# EAGLE design fcu-display (EAGLE 9.5.2)
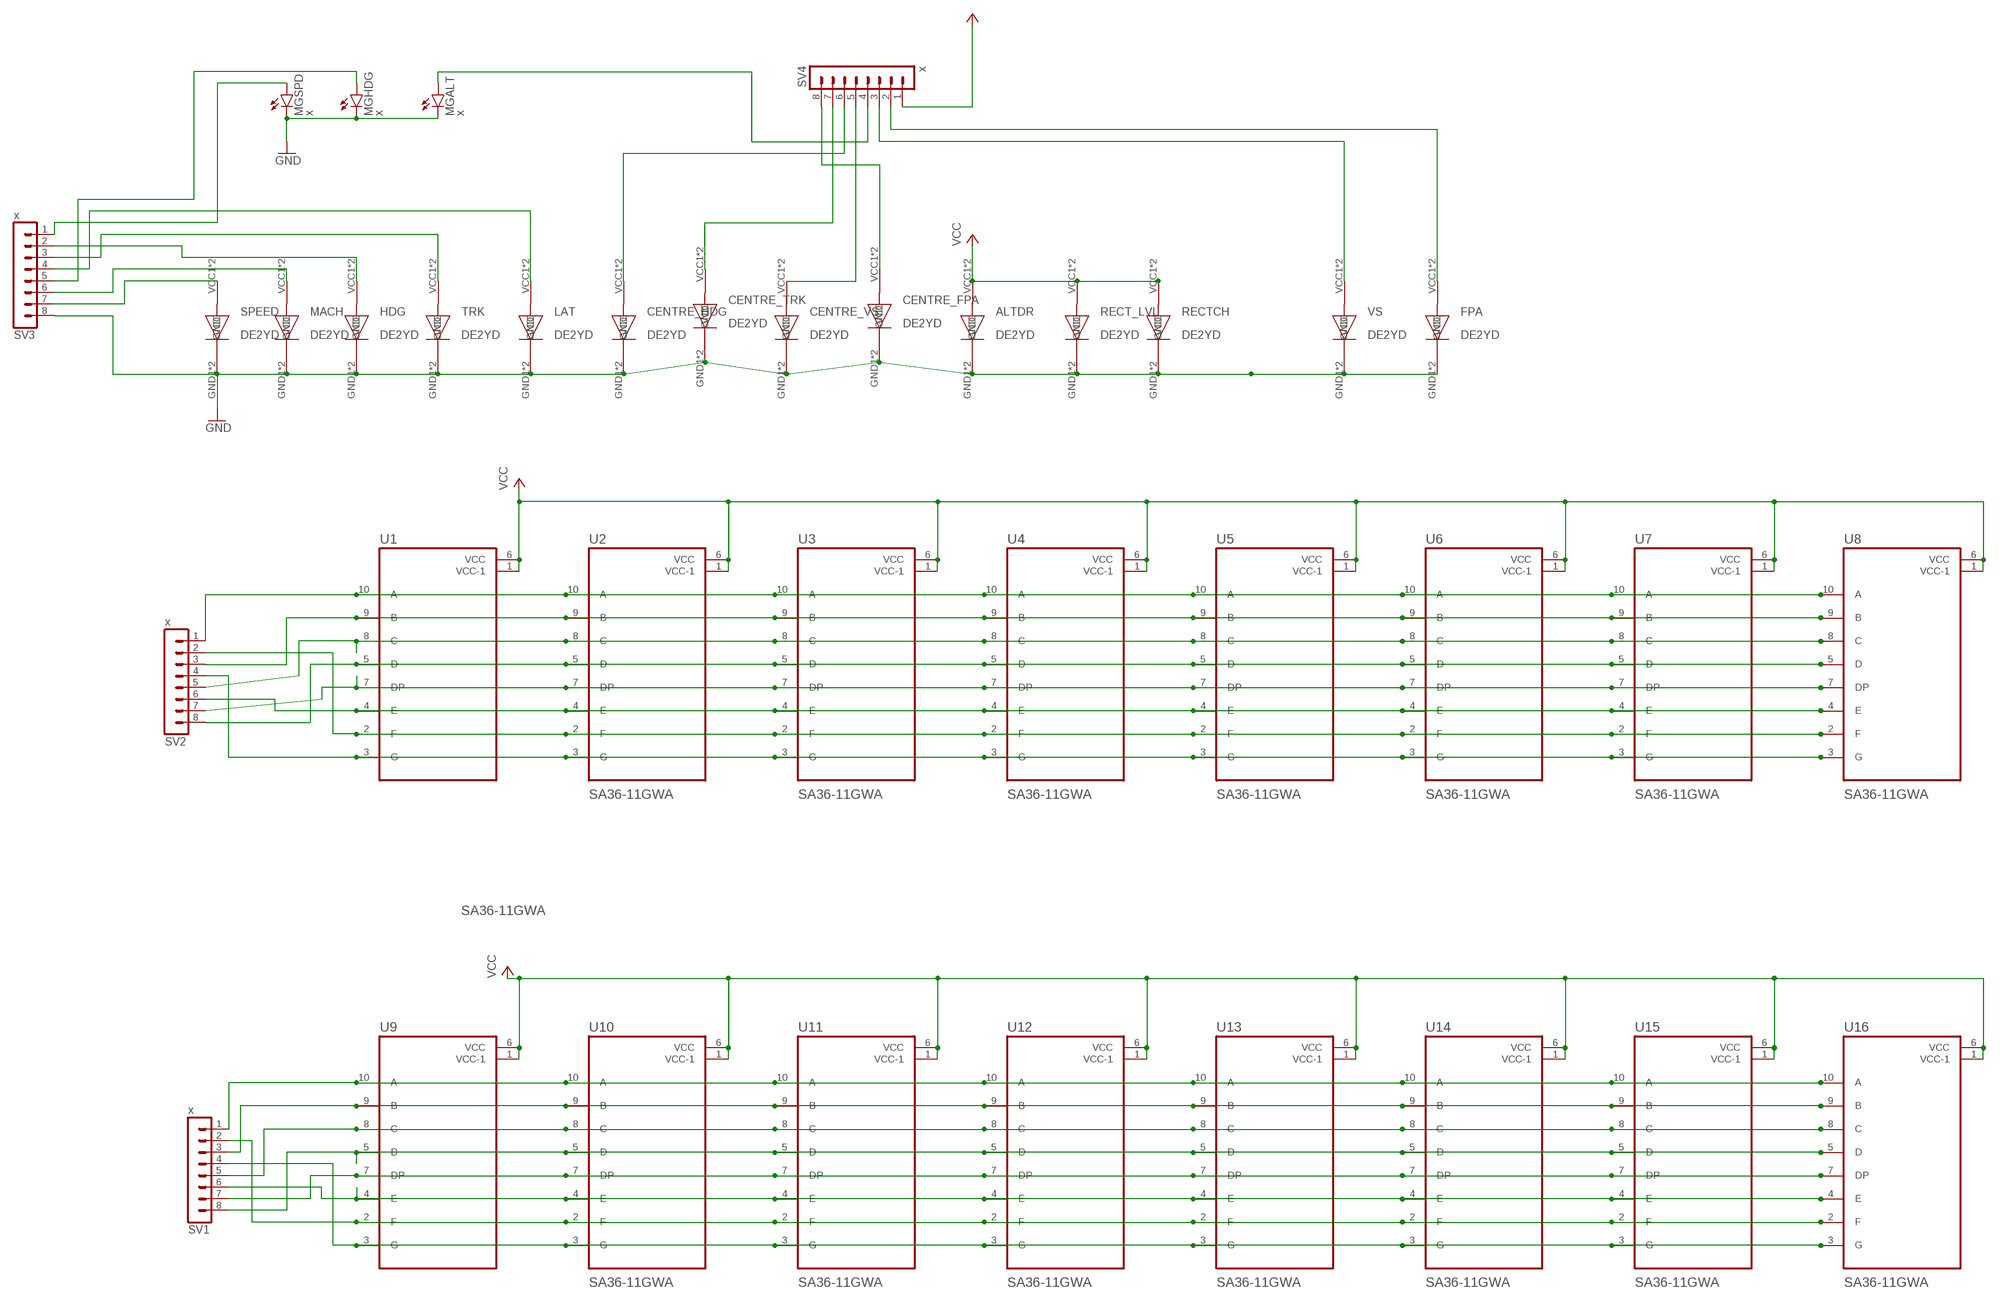
[diagram p0: schematic, sheet 1]

## Parts
ALTDR  DE2YD  [STANDARD]
CENTRE_FPA  DE2YD  [STANDARD]
CENTRE_HDG  DE2YD  [STANDARD]
CENTRE_TRK  DE2YD  [STANDARD]
CENTRE_VS  DE2YD  [STANDARD]
FPA  DE2YD  [STANDARD]
HDG  DE2YD  [STANDARD]
LAT  DE2YD  [STANDARD]
MACH  DE2YD  [STANDARD]
MGALT  x  LED3MM  [LED3MM]
MGHDG  x  LED3MM  [LED3MM]
MGSPD  x  LED3MM  [LED3MM]
RECT_LVL  DE2YD  [STANDARD]
RECTCH  DE2YD  [STANDARD]
SPEED  DE2YD  [STANDARD]
SV1  x  MA08-1  [MA08-1]
SV2  x  MA08-1  [MA08-1]
SV3  x  MA08-1  [MA08-1]
SV4  x  MA08-1  [MA08-1]
TRK  DE2YD  [STANDARD]
U1  SA36-11GWA  [KINGBRIGHT_SC36-11SRWA]
U2  SA36-11GWA  [KINGBRIGHT_SC36-11SRWA]
U3  SA36-11GWA  [KINGBRIGHT_SC36-11SRWA]
U4  SA36-11GWA  [KINGBRIGHT_SC36-11SRWA]
U5  SA36-11GWA  [KINGBRIGHT_SC36-11SRWA]
U6  SA36-11GWA  [KINGBRIGHT_SC36-11SRWA]
U7  SA36-11GWA  [KINGBRIGHT_SC36-11SRWA]
U8  SA36-11GWA  [KINGBRIGHT_SC36-11SRWA]
U9  SA36-11GWA  [KINGBRIGHT_SC36-11SRWA]
U10  SA36-11GWA  [KINGBRIGHT_SC36-11SRWA]
U11  SA36-11GWA  [KINGBRIGHT_SC36-11SRWA]
U12  SA36-11GWA  [KINGBRIGHT_SC36-11SRWA]
U13  SA36-11GWA  [KINGBRIGHT_SC36-11SRWA]
U14  SA36-11GWA  [KINGBRIGHT_SC36-11SRWA]
U15  SA36-11GWA  [KINGBRIGHT_SC36-11SRWA]
U16  SA36-11GWA  [KINGBRIGHT_SC36-11SRWA]
VS  DE2YD  [STANDARD]

## Nets
GND: ALTDR.GND1(GND) ALTDR.GND2(GND) CENTRE_FPA.GND1(GND) CENTRE_FPA.GND2(GND) CENTRE_HDG.GND1(GND) CENTRE_HDG.GND2(GND) CENTRE_TRK.GND1(GND) CENTRE_TRK.GND2(GND) CENTRE_VS.GND1(GND) CENTRE_VS.GND2(GND) FPA.GND1(GND) FPA.GND2(GND) HDG.GND1(GND) HDG.GND2(GND) LAT.GND1(GND) LAT.GND2(GND) MACH.GND1(GND) MACH.GND2(GND) MGALT.K(C) MGHDG.K(C) MGSPD.K(C) RECT_LVL.GND1(GND) RECT_LVL.GND2(GND) RECTCH.GND1(GND) RECTCH.GND2(GND) SPEED.GND1(GND) SPEED.GND2(GND) SV3.8 TRK.GND1(GND) TRK.GND2(GND) VS.GND1(GND) VS.GND2(GND)
N$1: SV2.1 U1.10(A) U2.10(A) U3.10(A) U4.10(A) U5.10(A) U6.10(A) U7.10(A) U8.10(A)
N$2: LAT.VCC1(VCC) LAT.VCC2(VCC) SV3.4
N$3: SV2.5 U1.8(C) U2.8(C) U3.8(C) U4.8(C) U5.8(C) U6.8(C) U7.8(C) U8.8(C)
N$4: MGSPD.A SV3.1
N$5: SV2.7 U1.7(DP) U2.7(DP) U3.7(DP) U4.7(DP) U5.7(DP) U6.7(DP) U7.7(DP) U8.7(DP)
N$6: MGHDG.A SV3.5
N$7: SV2.2 U1.2(F) U2.2(F) U3.2(F) U4.2(F) U5.2(F) U6.2(F) U7.2(F) U8.2(F)
N$8: FPA.VCC1(VCC) FPA.VCC2(VCC) SV4.2
N$9: SV4.3 VS.VCC1(VCC) VS.VCC2(VCC)
N$10: CENTRE_FPA.VCC1(VCC) CENTRE_FPA.VCC2(VCC) SV4.8
N$11: CENTRE_TRK.VCC1(VCC) CENTRE_TRK.VCC2(VCC) SV4.7
N$12: CENTRE_HDG.VCC1(VCC) CENTRE_HDG.VCC2(VCC) SV4.6
N$13: SV1.1 U9.10(A) U10.10(A) U11.10(A) U12.10(A) U13.10(A) U14.10(A) U15.10(A) U16.10(A)
N$14: SPEED.VCC1(VCC) SPEED.VCC2(VCC) SV3.7
N$15: MACH.VCC1(VCC) MACH.VCC2(VCC) SV3.6
N$16: SV1.5 U9.8(C) U10.8(C) U11.8(C) U12.8(C) U13.8(C) U14.8(C) U15.8(C) U16.8(C)
N$17: HDG.VCC1(VCC) HDG.VCC2(VCC) SV3.2
N$18: SV1.7 U9.7(DP) U10.7(DP) U11.7(DP) U12.7(DP) U13.7(DP) U14.7(DP) U15.7(DP) U16.7(DP)
N$19: SV3.3 TRK.VCC1(VCC) TRK.VCC2(VCC)
N$20: SV1.2 U9.2(F) U10.2(F) U11.2(F) U12.2(F) U13.2(F) U14.2(F) U15.2(F) U16.2(F)
N$21: CENTRE_VS.VCC1(VCC) CENTRE_VS.VCC2(VCC) SV4.5
N$22: MGALT.A SV4.4
N$28: SV1.4 U9.3(G) U10.3(G) U11.3(G) U12.3(G) U13.3(G) U14.3(G) U15.3(G) U16.3(G)
N$29: SV1.6 U9.4(E) U10.4(E) U11.4(E) U12.4(E) U13.4(E) U14.4(E) U15.4(E) U16.4(E)
N$30: SV1.8 U9.5(D) U10.5(D) U11.5(D) U12.5(D) U13.5(D) U14.5(D) U15.5(D) U16.5(D)
N$31: SV1.3 U9.9(B) U10.9(B) U11.9(B) U12.9(B) U13.9(B) U14.9(B) U15.9(B) U16.9(B)
N$57: SV2.4 U1.3(G) U2.3(G) U3.3(G) U4.3(G) U5.3(G) U6.3(G) U7.3(G) U8.3(G)
N$59: SV2.6 U1.4(E) U2.4(E) U3.4(E) U4.4(E) U5.4(E) U6.4(E) U7.4(E) U8.4(E)
N$61: SV2.8 U1.5(D) U2.5(D) U3.5(D) U4.5(D) U5.5(D) U6.5(D) U7.5(D) U8.5(D)
N$63: SV2.3 U1.9(B) U2.9(B) U3.9(B) U4.9(B) U5.9(B) U6.9(B) U7.9(B) U8.9(B)
VCC: ALTDR.VCC1(VCC) ALTDR.VCC2(VCC) RECT_LVL.VCC1(VCC) RECT_LVL.VCC2(VCC) RECTCH.VCC1(VCC) RECTCH.VCC2(VCC) SV4.1 U1.1(VCC-1) U1.6(VCC) U2.1(VCC-1) U2.6(VCC) U3.1(VCC-1) U3.6(VCC) U4.1(VCC-1) U4.6(VCC) U5.1(VCC-1) U5.6(VCC) U6.1(VCC-1) U6.6(VCC) U7.1(VCC-1) U7.6(VCC) U8.1(VCC-1) U8.6(VCC) U9.1(VCC-1) U9.6(VCC) U10.1(VCC-1) U10.6(VCC) U11.1(VCC-1) U11.6(VCC) U12.1(VCC-1) U12.6(VCC) U13.1(VCC-1) U13.6(VCC) U14.1(VCC-1) U14.6(VCC) U15.1(VCC-1) U15.6(VCC) U16.1(VCC-1) U16.6(VCC)

## Library data of the parts
ALTDR CENTRE_FPA CENTRE_HDG CENTRE_TRK CENTRE_VS FPA HDG LAT MACH RECT_LVL RECTCH SPEED TRK VS = kingbright-de2yd-lightbar:DE2YD
MGALT MGHDG MGSPD = led:LED: LED OSRAM: - CHIPLED LG R971, LG N971, LY N971, LG Q971, LY Q971, LO R971, LY R971 LH N974, LH R974 LS Q976, LO Q976, LY Q976 LO Q996 - Hyper CHIPLED LW Q18S LB Q993, LB Q99A, LB R99A - SideLED LS A670, LO A670, LY A670, LG A670, LP A670 LB A673, LV A673, LT A673, LW A673 LH A674 LY A675 LS A676, LA A676, LO A676, LY A676, LW A676 LS A679, LY A679, LG A679 - Hyper Micro SIDELED® LS Y876, LA Y876, LO Y876, LY Y876 LT Y87S - SmartLED LW L88C, LW L88S LB L89C, LB L89S, LG L890 LS L89K, LO L89K, LY L89K LS L896, LA L896, LO L896, LY L896 - TOPLED LS T670, LO T670, LY T670, LG T670, LP T670 LSG T670, LSP T670, LSY T670, LOP T670, LYG T670 LG T671, LOG T671, LSG T671 LB T673, LV T673, LT T673, LW T673 LH T674 LS T676, LA T676, LO T676, LY T676, LB T676, LH T676, LSB T676, LW T676 LB T67C, LV T67C, LT T67C, LS T67K, LO T67K, LY T67K, LW E67C LS E67B, LA E67B, LO E67B, LY E67B, LB E67C, LV E67C, LT E67C LW T67C LS T679, LY T679, LG T679 LS T770, LO T770, LY T770, LG T770, LP T770 LB T773, LV T773, LT T773, LW T773 LH T774 LS E675, LA E675, LY E675, LS T675 LS T776, LA T776, LO T776, LY T776, LB T776 LHGB T686 LT T68C, LB T68C - Hyper Mini TOPLED® LB M676 - Mini TOPLED Santana® LG M470 LS M47K, LO M47K, LY M47K Source: http://www.osram.convergy.de LUXEON: - LUMILED® LXK2-PW12-R00, LXK2-PW12-S00, LXK2-PW14-U00, LXK2-PW14-V00 LXK2-PM12-R00, LXK2-PM12-S00, LXK2-PM14-U00 LXK2-PE12-Q00, LXK2-PE12-R00, LXK2-PE12-S00, LXK2-PE14-T00, LXK2-PE14-U00 LXK2-PB12-K00, LXK2-PB12-L00, LXK2-PB12-M00, LXK2-PB14-N00, LXK2-PB14-P00, LXK2-PB14-Q00 LXK2-PR12-L00, LXK2-PR12-M00, LXK2-PR14-Q00, LXK2-PR14-R00 LXK2-PD12-Q00, LXK2-PD12-R00, LXK2-PD12-S00 LXK2-PH12-R00, LXK2-PH12-S00 LXK2-PL12-P00, LXK2-PL12-Q00, LXK2-PL12-R00 Source: www.luxeon.com KINGBRIGHT: KA-3528ASYC Source: www.kingbright.com
SV1-SV4 = con-lstb:MA08-1: PIN HEADER; OC_FARNELL: unknown; OC_NEWARK: unknown
U1-U16 = SA36-11GWA:SA36-11GWA: None; AVAILABILITY: Unavailable; DESCRIPTION: Character LED Display Module Green 7-Segment 1 Character Common Anode 2.2V 20mA 0.551 H x 0.295 W x 0.335 D _14.00mm x 7.50mm x 8.50mm_ 10-DIP _0.200, 5.08mm_; MF: Kingbright; MP: SA36-11GWA; PACKAGE: DIP-10 Kingbright; PRICE: None

## Net classes
0 default: width 0.406 mm

## Board
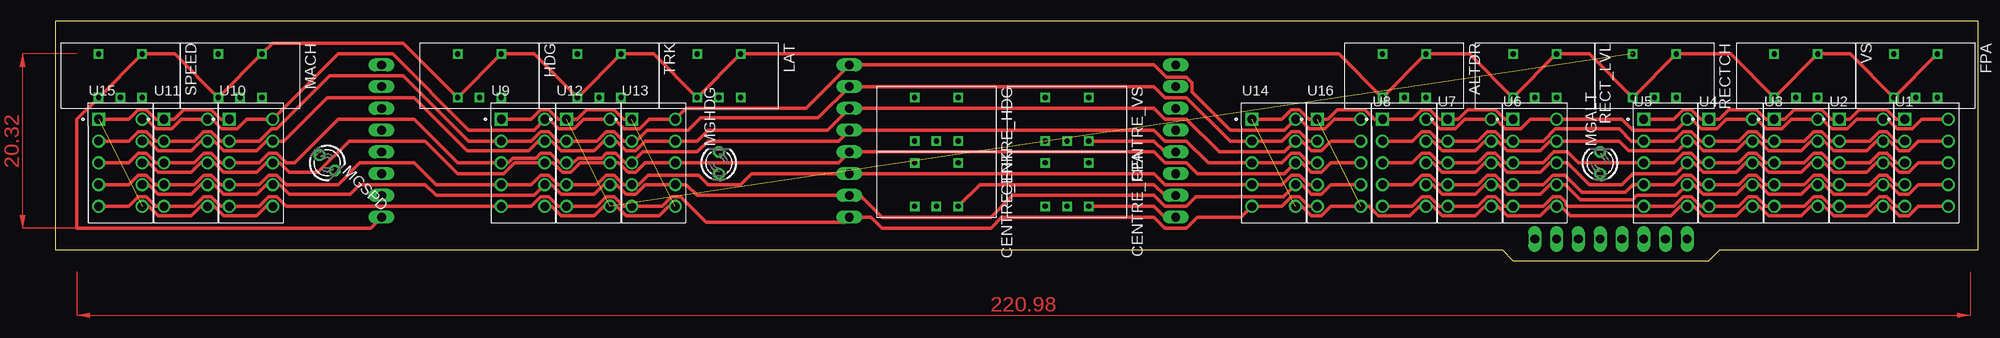
[diagram p1: board, top side]
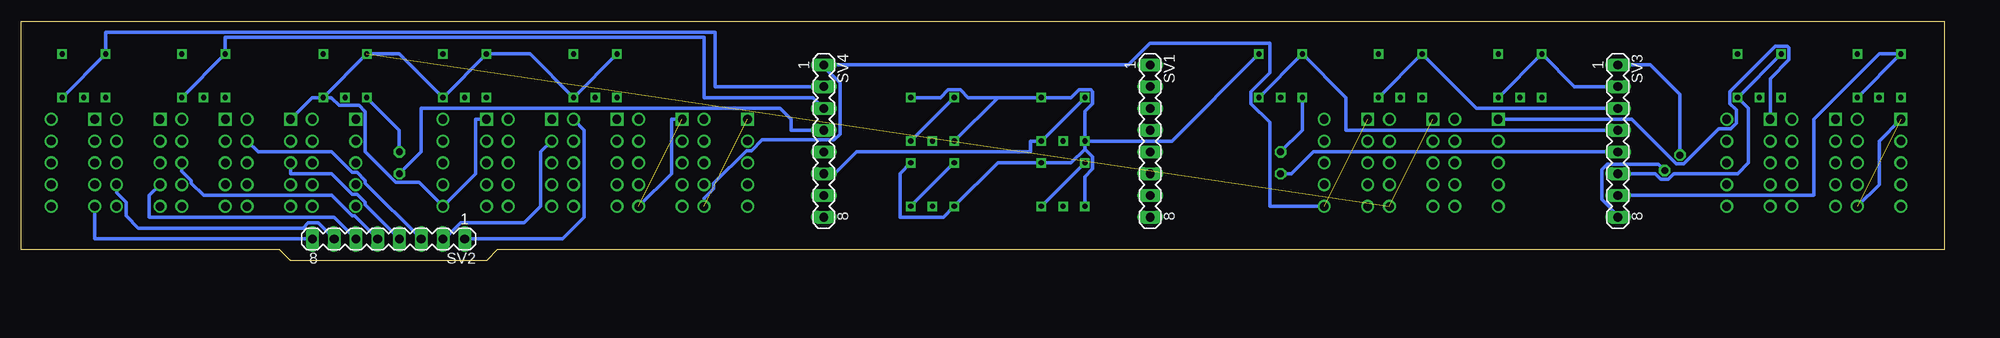
[diagram p2: board, bottom side, seen from below]

Size 224.46 x 27.93 mm. Coordinates in mm from the lower left corner, seen from the top.
Outline: 0,1.27 168.91,1.27 170.18,0 193.04,0 194.31,1.27 224.46,1.27 224.46,27.93 0,27.93 0,1.27
Copper layers (1*16): Top 0.035mm / dielectric 1.5mm / Bottom 0.035mm
Design rules "default": minimum track width 6mil, minimum drill 0.35mm, track to track 6mil, track to pad 6mil, pad to pad 6mil, via to via 6mil, smd to smd 6mil, copper to edge 40mil, drill to drill 6mil, minimum pad ring 10mil, minimum via ring 8mil, stop-mask expansion 4mil, vias tented up to drill 0mil, thermal gap 10mil

### Footprints (pad centres in the part's own frame; a part is rotated, then mirrored left to right if it is on the bottom)
STANDARD = drill 0.6 square: GND1 1.27,-2.54; GND2 -3.81,2.54; NC 1.27,0; VCC1 -3.81,-2.54; VCC2 1.27,2.54
LED3MM = drill 0.813 octagon: A -1.27,0; K 1.27,0
MA08-1 = drill 1.016 long: 1 -8.89,0; 2 -6.35,0; 3 -3.81,0; 4 -1.27,0; 5 1.27,0; 6 3.81,0; 7 6.35,0; 8 8.89,0
KINGBRIGHT_SC36-11SRWA = drill 1 square: 1 -2.54,5.08 | drill 1: 2 -2.54,2.54; 3 -2.54,0; 4 -2.54,-2.54; 5 -2.54,-5.08; 6 2.54,-5.08; 7 2.54,-2.54; 8 2.54,0; 9 2.54,2.54; 10 2.54,5.08

### Placement (x,y rotation side)
ALTDR  157.48,20.32 270 top
CENTRE_FPA  118.11,7.62 270 top
CENTRE_HDG  102.87,15.24 270 top
CENTRE_TRK  102.87,7.62 270 top
CENTRE_VS  118.11,15.24 270 top
FPA  217.17,20.32 270 top
HDG  49.53,20.32 270 top
LAT  77.47,20.32 270 top
MACH  21.59,20.32 270 top
MGALT  180.34,11.43 90 top
MGHDG  77.47,11.43 90 top
MGSPD  31.75,11.43 315 top
RECT_LVL  172.72,20.32 270 top
RECTCH  186.69,20.32 270 top
SPEED  7.62,20.32 270 top
SV1  92.71,13.97 270 bottom
SV2  181.61,2.54 180 bottom
SV3  38.1,13.97 270 bottom
SV4  130.81,13.97 270 bottom
TRK  63.5,20.32 270 top
U1  218.44,11.43 0 top
U2  210.82,11.43 0 top
U3  203.2,11.43 0 top
U4  195.58,11.43 0 top
U5  187.96,11.43 0 top
U6  172.72,11.43 0 top
U7  165.1,11.43 0 top
U8  157.48,11.43 0 top
U9  54.61,11.43 0 top
U10  22.86,11.43 0 top
U11  15.24,11.43 0 top
U12  62.23,11.43 0 top
U13  69.85,11.43 0 top
U14  142.24,11.43 0 top
U15  7.62,11.43 0 top
U16  149.86,11.43 0 top
VS  203.2,20.32 270 top

### Tracks (layer width: path | path; a pad name or v marks a point on that pad's centre or on a via)
GND
  Top 0.406: SV3.8 36.83,3.81 2.54,3.81 2.54,16.51 SPEED.GND1 SPEED.GND2 13.97,24.13 MACH.GND1 MACH.GND2 25.4,25.4 40.64,25.4 HDG.GND1 HDG.GND2 55.88,24.13 TRK.GND1 TRK.GND2 69.85,24.13 LAT.GND1 LAT.GND2 149.86,24.13 ALTDR.GND1 ALTDR.GND2 165.1,24.13 RECT_LVL.GND1 RECT_LVL.GND2 179.07,24.13 RECTCH.GND1 RECTCH.GND2 195.58,24.13 VS.GND1 VS.GND2 209.55,24.13 FPA.GND1 FPA.GND2
  Bottom 0.406: SV3.8 38.1,5.28 39.98,7.16 39.98,10.62 39.33,11.28 33.39,11.28 MGSPD.K | MGHDG.K 74.93,15.24 LAT.GND1 | MGALT.K 180.34,15.24 RECTCH.GND1 | CENTRE_TRK.GND1 100.33,9.82 99.42,10.73 99.42,12.13 100.33,13.04 | CENTRE_HDG.GND1 100.33,13.04 | 100.33,13.04 101.94,11.43 CENTRE_TRK.GND2 110.49,11.43 CENTRE_FPA.GND1 116.84,5.08 121.92,5.08 121.92,10.16 CENTRE_FPA.GND2 | CENTRE_HDG.GND1 100.33,17.44 99.42,18.35 99.42,19.75 99.63,19.96 101.03,19.96 101.94,19.05 CENTRE_HDG.GND2 110.49,19.05 | 110.49,19.05 CENTRE_VS.GND1 | 110.49,19.05 113.96,19.05 114.87,19.96 116.27,19.96 117.18,19.05 CENTRE_VS.GND2 | LAT.GND2 90.17,13.97 CENTRE_HDG.GND1
N$1
  Top 0.406: U1.10 217.91,16.51 216.8,15.4 215,15.4 213.89,16.51 U2.10 210.29,16.51 209.18,15.4 207.38,15.4 206.27,16.51 U3.10 202.67,16.51 201.56,15.4 199.76,15.4 198.65,16.51 U4.10 195.05,16.51 193.94,15.4 192.14,15.4 191.03,16.51 U5.10 189.23,15.24 184.15,15.24 182.88,16.51 U6.10 172.19,16.51 171.08,15.4 169.28,15.4 168.17,16.51 U7.10 164.57,16.51 163.46,15.4 161.66,15.4 160.55,16.51 U8.10
  Bottom 0.406: SV2.1 161.29,2.54 158.75,5.08 158.75,15.24 U8.10
N$2
  Bottom 0.406: SV3.4 69.85,15.24 69.85,19.05 LAT.VCC1 LAT.VCC2
N$3
  Top 0.406: U1.8 217.47,11.43 216.36,10.32 215.25,10.32 214.14,11.43 U2.8 212.58,11.43 211.47,10.32 207.63,10.32 206.52,11.43 U3.8 204.96,11.43 203.85,10.32 200.01,10.32 198.9,11.43 U4.8 197.34,11.43 196.23,10.32 192.39,10.32 191.28,11.43 U5.8 189.23,10.16 184.15,10.16 182.88,8.89 179.07,8.89 176.53,11.43 U6.8 174.48,11.43 173.37,10.32 169.53,10.32 168.42,11.43 U7.8 166.86,11.43 165.75,10.32 161.91,10.32 160.8,11.43 U8.8
  Bottom 0.406: SV2.5 185.58,5.24 185.88,5.24 188.26,7.62 203.2,7.62 204.63,9.05 204.63,9.35 205.74,10.46 U3.8
N$4
  Bottom 0.406: MGSPD.A 30.85,19.42 34.29,22.86 SV3.1
N$5
  Top 0.406: U1.7 217.47,8.89 216.36,7.78 215.25,7.78 214.14,8.89 U2.7 212.58,8.89 211.47,7.78 207.63,7.78 206.52,8.89 U3.7 204.96,8.89 203.85,7.78 200.01,7.78 198.9,8.89 U4.7 197.34,8.89 196.23,7.78 192.39,7.78 191.28,8.89 U5.7 189.23,7.62 184.64,7.62 184.13,7.11 178.05,7.11 176.28,8.89 U6.7 174.48,8.89 173.37,7.78 169.53,7.78 168.42,8.89 U7.7 166.86,8.89 165.75,7.78 161.91,7.78 160.8,8.89 U8.7
  Bottom 0.406: SV2.7 189.84,4.42 190.96,4.42 191.57,3.81 210.82,3.81 212.25,5.24 212.25,6.81 213.36,7.92 U2.7
N$6
  Bottom 0.406: MGHDG.A 76.2,10.16 73.66,12.7 SV3.5
N$7
  Top 0.406: U1.2 214.93,13.97 213.82,15.08 212.9,15.08 211.79,13.97 U2.2 207.31,13.97 206.2,15.08 205.28,15.08 204.17,13.97 U3.2 199.69,13.97 198.58,15.08 197.66,15.08 196.55,13.97 U4.2 192.07,13.97 190.96,15.08 190.04,15.08 188.93,13.97 U5.2 184,13.97 182.56,15.4 175.12,15.4 173.69,13.97 U6.2 169.21,13.97 168.1,15.08 167.18,15.08 166.07,13.97 U7.2 161.59,13.97 160.48,15.08 159.56,15.08 158.45,13.97 U8.2
  Bottom 0.406: SV2.2 175.06,2.54 173.18,4.42 165.76,4.42 163.83,6.35 163.83,12.7 U7.2
N$8
  Bottom 0.406: FPA.VCC2 FPA.VCC1 214.63,26.67 143.51,26.67 143.51,20.32 SV4.2
N$9
  Bottom 0.406: VS.VCC2 VS.VCC1 200.66,26.11 144.78,26.11 144.78,19.05 132.08,19.05 SV4.3
N$10
  Top 0.406: SV4.8 129.54,5.08 128.27,6.35 CENTRE_FPA.VCC2
  Bottom 0.406: CENTRE_FPA.VCC1 CENTRE_FPA.VCC2
N$11
  Top 0.406: SV4.7 129.54,7.62 128.27,8.89 107.95,8.89 CENTRE_TRK.VCC2
  Bottom 0.406: CENTRE_TRK.VCC1 CENTRE_TRK.VCC2
N$12
  Bottom 0.406: SV4.6 129.54,10.16 127,12.7 106.68,12.7 106.68,13.97 CENTRE_HDG.VCC2 CENTRE_HDG.VCC1
N$13
  Top 0.406: U15.10 10.69,16.51 11.8,15.4 13.6,15.4 14.71,16.51 U11.10 18.31,16.51 19.42,15.4 21.22,15.4 22.33,16.51 U10.10 33.02,24.13 39.37,24.13 48.26,15.24 55.88,15.24 U9.10 57.68,16.51 58.79,15.4 60.59,15.4 61.7,16.51 U12.10 65.3,16.51 66.41,15.4 68.21,15.4 69.32,16.51 U13.10 73.66,17.78 87.63,17.78 SV1.1 128.27,22.86 129.69,21.44 132.03,21.44 132.69,20.78 132.69,19.71 137.16,15.24 143.51,15.24 U14.10 145.31,16.51 146.42,15.4 148.22,15.4 149.33,16.51 U16.10
N$14
  Bottom 0.406: SV3.7 15.24,7.62 15.24,16.51 7.62,24.13 SPEED.VCC1 SPEED.VCC2
N$15
  Bottom 0.406: SV3.6 33.71,10.16 33.07,9.52 32.23,9.52 31.58,10.16 24.13,10.16 22.86,11.43 22.86,17.78 MACH.VCC2 MACH.VCC1
N$16
  Top 0.406: U15.8 10.94,11.43 12.05,10.32 15.89,10.32 17,11.43 U11.8 18.56,11.43 19.67,10.32 23.51,10.32 24.62,11.43 U10.8 26.18,11.43 27.29,10.32 30.64,10.32 34.29,13.97 43.18,13.97 46.99,10.16 52.37,10.16 53.64,11.43 U9.8 58.12,11.43 59.23,10.32 60.15,10.32 61.26,11.43 U12.8 65.74,11.43 66.85,10.32 67.77,10.32 68.88,11.43 U13.8 91.44,11.43 SV1.5 128.27,12.7 129.54,11.43 132.08,11.43 133.35,10.16 143.51,10.16 U14.8 145.56,11.43 146.67,10.32 147.78,10.32 148.89,11.43 U16.8
N$17
  Bottom 0.406: SV3.2 43.18,20.32 HDG.VCC1 HDG.VCC2
N$18
  Top 0.406: U15.7 10.94,8.89 12.05,7.78 15.89,7.78 17,8.89 U11.7 18.56,8.89 19.67,7.78 23.51,7.78 24.62,8.89 U10.7 26.18,8.89 27.29,7.78 34.45,7.78 35.56,8.89 43.18,8.89 44.45,7.62 55.88,7.62 U9.7 57.93,8.89 59.04,7.78 62.88,7.78 63.99,8.89 U12.7 65.55,8.89 66.66,7.78 67.77,7.78 68.88,8.89 U13.7 73.66,8.89 74.93,7.62 SV1.7 93.98,7.62 96.52,5.08 109.22,5.08 111.76,7.62 128.27,7.62 129.54,6.35 132.08,6.35 133.19,7.46 143.35,7.46 U14.7 145.56,8.89 146.67,7.78 147.78,7.78 148.89,8.89 U16.7
N$19
  Bottom 0.406: SV3.3 54.61,17.78 TRK.VCC1 TRK.VCC2
N$20
  Top 0.406: U15.2 8.59,13.97 9.7,15.08 10.62,15.08 11.73,13.97 U11.2 16.21,13.97 17.32,15.08 18.24,15.08 19.35,13.97 U10.2 23.83,13.97 25.26,15.4 25.86,15.4 32.05,21.59 40.64,21.59 48.26,13.97 U9.2 55.58,13.97 56.69,15.08 57.61,15.08 58.72,13.97 U12.2 63.2,13.97 64.31,15.08 65.23,15.08 66.34,13.97 U13.2 67.82,13.97 69.07,15.22 73.9,15.22 75.35,16.67 89.06,16.67 SV1.2 128.27,20.32 129.54,19.05 132.08,19.05 137.16,13.97 U14.2 143.21,13.97 144.32,15.08 145.24,15.08 146.35,13.97 U16.2
N$21
  Top 0.406: SV4.5 129.54,12.7 128.27,13.97 CENTRE_VS.VCC2
  Bottom 0.406: CENTRE_VS.VCC1 CENTRE_VS.VCC2
N$22
  Bottom 0.406: MGALT.A 177.8,12.7 177.8,17.78 135.89,17.78 134.62,16.51 134.62,15.24 SV4.4
N$26  (1 unrouted)
N$27  (1 unrouted)
N$28
  Top 0.406: U15.3 8.59,11.43 9.7,12.54 10.62,12.54 11.73,11.43 U11.3 16.21,11.43 17.32,12.54 18.24,12.54 19.35,11.43 U10.3 23.83,11.43 24.94,12.54 25.86,12.54 26.97,11.43 27.94,11.43 33.02,16.51 41.91,16.51 46.99,11.43 U9.3 52.85,11.43 53.41,11.99 56.14,11.99 56.69,12.54 57.8,12.54 58.91,11.43 U12.3 60.47,11.43 61.03,11.99 63.76,11.99 64.31,12.54 65.42,12.54 66.53,11.43 U13.3 68.58,12.7 74.93,12.7 76.2,13.97 91.44,13.97 SV1.4 128.27,15.24 129.54,13.97 132.08,13.97 134.62,11.43 U14.3 143.21,11.43 144.32,12.54 145.24,12.54 146.35,11.43 U16.3
N$29
  Top 0.406: U15.4 8.59,8.89 9.7,10 10.62,10 11.73,8.89 U11.4 16.21,8.89 17.32,10 18.24,10 19.35,8.89 U10.4 23.83,8.89 24.94,10 25.86,10 26.97,8.89 33.02,8.89 35.56,11.43 41.91,11.43 44.45,8.89 U9.4 55.58,8.89 56.69,10 57.61,10 58.72,8.89 U12.4 63.2,8.89 64.31,10 65.23,10 66.34,8.89 U13.4 68.09,8.89 69.2,10 75.09,10 76.2,8.89 80.01,8.89 81.28,10.16 SV1.6 128.27,10.16 129.54,8.89 U14.4 143.21,8.89 144.32,10 145.24,10 146.35,8.89 U16.4
N$30
  Top 0.406: U15.5 8.59,6.35 9.7,7.46 10.62,7.46 11.73,6.35 U11.5 16.21,6.35 17.32,7.46 18.24,7.46 19.35,6.35 U10.5 23.83,6.35 24.94,7.46 25.86,7.46 26.97,6.35 U9.5 55.58,6.35 56.69,7.46 57.61,7.46 58.72,6.35 U12.5 63.2,6.35 64.31,7.46 65.23,7.46 66.34,6.35 U13.5 70.82,6.35 71.93,7.46 73.03,7.46 75.97,4.52 92.15,4.52 SV1.8 95.25,5.08 96.52,3.81 109.22,3.81 110.49,5.08 128.27,5.08 129.54,3.81 132.08,3.81 133.35,5.08 138.43,5.08 U14.5 143.21,6.35 144.32,7.46 145.24,7.46 146.35,6.35 U16.5
N$31
  Top 0.406: U15.9 10.94,13.97 12.05,12.86 15.89,12.86 17,13.97 U11.9 18.56,13.97 19.67,12.86 23.51,12.86 24.62,13.97 U10.9 26.67,13.97 31.75,19.05 41.91,19.05 48.1,12.86 55.26,12.86 56.37,13.97 U9.9 57.93,13.97 59.04,12.86 62.88,12.86 63.99,13.97 U12.9 65.55,13.97 66.66,12.86 67.77,12.86 68.88,13.97 U13.9 74.93,13.97 76.2,15.24 90.17,15.24 SV1.3 128.27,17.78 129.54,16.51 132.08,16.51 135.89,12.7 143.51,12.7 U14.9 145.56,13.97 146.67,12.86 147.78,12.86 148.89,13.97 U16.9
N$32  (1 unrouted)
N$33  (1 unrouted)
N$34  (1 unrouted)
N$57
  Top 0.406: U1.3 214.93,11.43 213.82,12.54 212.9,12.54 211.79,11.43 U2.3 207.31,11.43 206.2,12.54 205.28,12.54 204.17,11.43 U3.3 199.69,11.43 198.58,12.54 197.66,12.54 196.55,11.43 U4.3 192.07,11.43 190.96,12.54 190.04,12.54 188.93,11.43 U5.3 177.8,11.43 176.53,12.7 174.96,12.7 173.69,11.43 U6.3 169.21,11.43 168.1,12.54 167.18,12.54 166.07,11.43 U7.3 161.59,11.43 160.48,12.54 159.56,12.54 158.45,11.43 U8.3
  Bottom 0.406: SV2.4 184.31,6.51 184.31,6.81 185.28,7.78 185.88,7.78 188.26,10.16 193.04,10.16 U4.3
N$59
  Top 0.406: U1.4 214.93,8.89 213.82,10 212.9,10 211.79,8.89 U2.4 207.31,8.89 206.2,10 205.28,10 204.17,8.89 U3.4 199.69,8.89 198.58,10 197.66,10 196.55,8.89 U4.4 192.07,8.89 190.96,10 190.04,10 188.93,8.89 U5.4 184.15,8.89 183.26,8 178.21,8 176.21,10 174.8,10 173.69,8.89 U6.4 169.21,8.89 168.1,10 167.18,10 166.07,8.89 U7.4 161.59,8.89 160.48,10 159.56,10 158.45,8.89 U8.4
  Bottom 0.406: SV2.6 187.96,5.08 209.55,5.08 209.55,7.62 U2.4
N$61
  Top 0.406: U1.5 214.93,6.35 213.82,7.46 212.9,7.46 211.79,6.35 U2.5 207.31,6.35 206.2,7.46 205.28,7.46 204.17,6.35 U3.5 199.69,6.35 198.58,7.46 197.66,7.46 196.55,6.35 U4.5 192.07,6.35 190.96,7.46 190.04,7.46 188.93,6.35 U5.5 176.53,6.35 176.37,6.51 176.37,6.81 175.72,7.46 174.8,7.46 173.69,6.35 U6.5 169.21,6.35 168.1,7.46 167.18,7.46 166.07,6.35 U7.5 161.59,6.35 160.48,7.46 159.56,7.46 158.45,6.35 U8.5
  Bottom 0.406: SV2.8 215.9,2.54 U1.5
N$63
  Top 0.406: U1.9 217.47,13.97 216.36,12.86 215.25,12.86 214.14,13.97 U2.9 212.58,13.97 211.47,12.86 207.63,12.86 206.52,13.97 U3.9 204.96,13.97 203.85,12.86 200.01,12.86 198.9,13.97 U4.9 197.34,13.97 196.23,12.86 192.39,12.86 191.28,13.97 U5.9 189.39,12.86 183.68,12.86 182.57,13.97 U6.9 174.48,13.97 173.37,12.86 169.53,12.86 168.42,13.97 U7.9 166.86,13.97 165.75,12.86 161.91,12.86 160.8,13.97 U8.9
  Bottom 0.406: SV2.3 184.31,9.05 184.31,9.35 185.28,10.32 185.88,10.32 188.26,12.7 196.85,12.7 U4.9
VCC  (1 unrouted)
  Top 0.406: U15.1 8.59,16.51 9.7,17.62 10.62,17.62 11.73,16.51 U11.1 13.92,16.51 15.03,17.62 18.24,17.62 19.35,16.51 U10.1 | U15.6 10.94,6.35 12.05,5.24 15.89,5.24 17,6.35 U11.6 18.56,6.35 19.67,5.24 23.51,5.24 24.62,6.35 U10.6 | U9.1 55.58,16.51 56.69,17.62 57.61,17.62 58.72,16.51 U12.1 60.91,16.51 62.02,17.62 65.23,17.62 66.34,16.51 U13.1 | U9.6 57.93,6.35 59.04,5.24 62.88,5.24 63.99,6.35 U12.6 65.55,6.35 66.66,5.24 70.5,5.24 71.61,6.35 U13.6 | U14.1 143.21,16.51 144.32,17.62 145.24,17.62 146.35,16.51 U16.1 148.54,16.51 149.65,17.62 152.86,17.62 153.97,16.51 | U14.6 145.56,6.35 146.67,5.24 147.78,5.24 148.89,6.35 U16.6 153.37,6.35 154.48,5.24 158.13,5.24 159.24,6.35 U8.6 160.8,6.35 161.91,5.24 165.75,5.24 166.86,6.35 U7.6 168.42,6.35 169.53,5.24 173.37,5.24 174.48,6.35 U6.6 175.74,6.35 176.85,5.24 188.61,5.24 189.72,6.35 U5.6 191.28,6.35 192.39,5.24 196.23,5.24 197.34,6.35 U4.6 198.9,6.35 200.01,5.24 203.85,5.24 204.96,6.35 U3.6 206.52,6.35 207.63,5.24 211.47,5.24 212.58,6.35 U2.6 214.14,6.35 215.25,5.24 216.36,5.24 217.47,6.35 U1.6 | U1.1 214.93,16.51 213.82,17.62 210.61,17.62 209.5,16.51 U2.1 207.31,16.51 206.2,17.62 202.99,17.62 201.88,16.51 U3.1 199.69,16.51 198.58,17.62 195.37,17.62 194.26,16.51 U4.1 192.07,16.51 190.96,17.62 190.04,17.62 188.93,16.51 U5.1 | U8.1 158.45,16.51 159.56,17.62 160.48,17.62 161.59,16.51 U7.1 163.78,16.51 164.89,17.62 168.1,17.62 169.21,16.51 U6.1
  Bottom 0.406: ALTDR.VCC1 ALTDR.VCC2 165.1,24.13 RECT_LVL.VCC1 RECT_LVL.VCC2 180.34,24.13 RECTCH.VCC1 RECTCH.VCC2 | RECTCH.VCC2 188.3,19.05 187.39,18.14 185.04,18.14 184.31,17.41 184.31,12.69 180.76,9.14 178.05,9.14 U6.6 171.45,10.16 171.45,16.51 U6.1 | U14.6 144.78,7.32 143.67,8.43 143.67,9.03 139.84,12.86 139.24,12.86 137.98,14.12 129.59,14.12 128.93,14.78 128.93,20.78 130.81,22.66 SV4.1 95.25,22.86 92.71,25.4 78.74,25.4 78.74,21.93 80.92,19.75 80.92,18.35 78.74,16.17 78.74,6.35 U13.6 | U16.6 148.59,10.16 148.59,16.51 U16.1 | U9.1 36.47,16.51 31.27,11.31 30.43,11.31 26.34,15.4 24.94,15.4 24.29,16.05 24.29,17.6 25.04,18.35 25.04,19.75 19.75,25.04 18.35,25.04 18.14,24.83 18.14,23.43 20.32,21.25 U10.1 | U15.1 7.62,13.97 7.62,8.89 U15.6 | RECTCH.VCC2 190.5,19.05 U4.1
(copper drawn outside any net)
  shapes: Top area x2